# Altium schematic sheet ТЗ.SchDoc
size A4
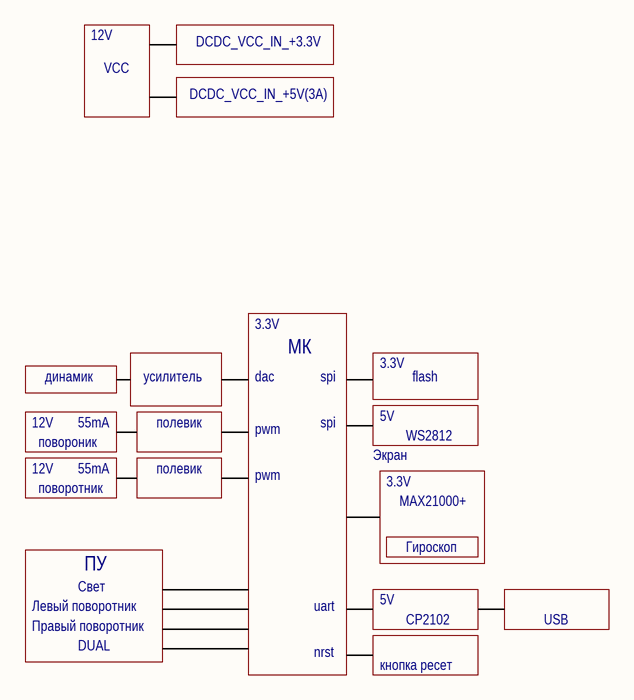
[diagram p0: ТЗ.SchDoc]

## Notes on the sheet
- 12V
- VCC
- DCDC_VCC_IN_+3.3V
- DCDC_VCC_IN_+5V(3A)
- динамик
- усилитель
- dac
- 3.3V
- МК
- spi
- flash
- повороник
- поворотник
- 55mA
- полевик
- pwm
- Экран
- 5V
- WS2812
- ПУ
- MAX21000+
- Гироскоп
- Левый поворотник
- Правый поворотник
- DUAL
- Свет
- uart
- nrst
- CP2102
- USB
- кнопка ресет